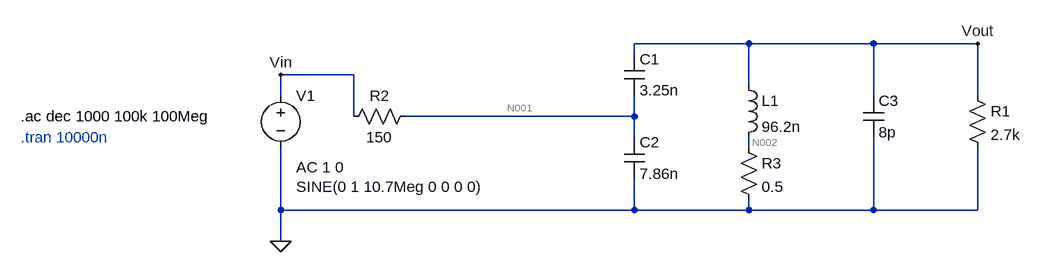
[diagram p0: schematic Draft7.asc]
Draft7.asc, the LTspice schematic file:
Version 4
SHEET 1 3220 680
WIRE 720 64 544 64
WIRE 912 64 720 64
WIRE 1072 64 912 64
WIRE 544 80 544 64
WIRE 112 112 0 112
WIRE 720 128 720 64
WIRE 0 144 0 112
WIRE 912 144 912 64
WIRE 1072 144 1072 64
WIRE 112 176 112 112
WIRE 544 176 544 144
WIRE 544 176 192 176
WIRE 544 208 544 176
WIRE 720 224 720 208
WIRE 0 320 0 224
WIRE 544 320 544 272
WIRE 544 320 0 320
WIRE 720 320 720 304
WIRE 720 320 544 320
WIRE 912 320 912 208
WIRE 912 320 720 320
WIRE 1072 320 1072 224
WIRE 1072 320 912 320
WIRE 0 368 0 320
FLAG 0 368 0
FLAG 0 112 Vin
FLAG 1072 64 Vout
SYMBOL voltage 0 128 R0
WINDOW 3 24 156 Left 2
WINDOW 123 24 126 Left 2
WINDOW 39 0 0 Left 0
SYMATTR Value SINE(0 1 10.7Meg 0 0 0 0)
SYMATTR Value2 AC 1 0
SYMATTR InstName V1
SYMBOL cap 528 80 R0
SYMATTR InstName C1
SYMATTR Value 3.25n
SYMBOL cap 528 208 R0
SYMATTR InstName C2
SYMATTR Value 7.86n
SYMBOL ind 704 112 R0
SYMATTR InstName L1
SYMATTR Value 96.2n
SYMBOL res 1056 128 R0
SYMATTR InstName R1
SYMATTR Value 2.7k
SYMBOL res 96 192 R270
WINDOW 0 32 56 VTop 2
WINDOW 3 0 56 VBottom 2
SYMATTR InstName R2
SYMATTR Value 150
SYMBOL cap 896 144 R0
SYMATTR InstName C3
SYMATTR Value 8p
SYMBOL res 704 208 R0
SYMATTR InstName R3
SYMATTR Value 0.5
TEXT -400 176 Left 2 !.ac dec 1000 100k 100Meg
TEXT -400 208 Left 2 ;.tran 10000n

The netlist it stands for:
* Draft7.asc
V1 Vin 0 SINE(0 1 10.7Meg 0 0 0 0) AC 1 0
C1 Vout N001 3.25n
C2 N001 0 7.86n
L1 Vout N002 96.2n
R1 Vout 0 2.7k
R2 Vin N001 150
C3 Vout 0 8p
R3 N002 0 0.5
.ac dec 1000 100k 100Meg
* .tran 10000n
.backanno
.end

* Results of the author's LTspice run, read from the files saved beside the schematic
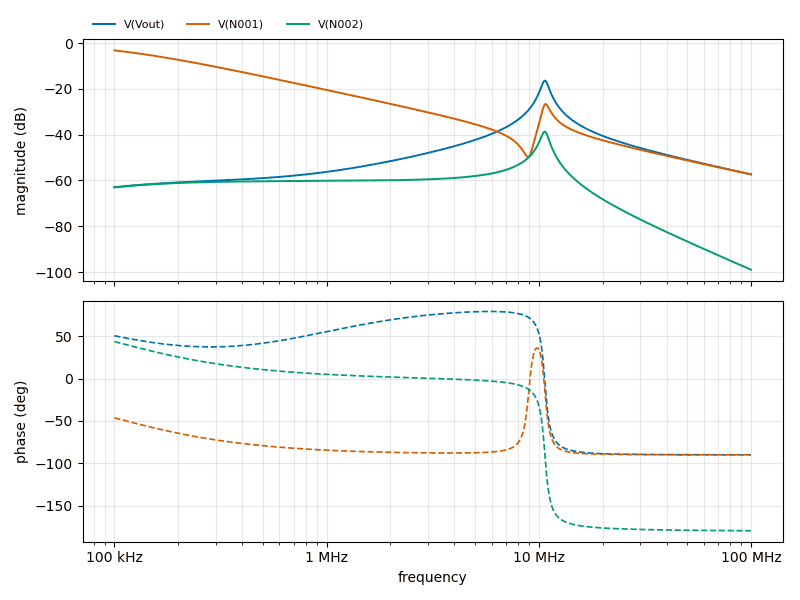
[diagram p1: AC Analysis of Draft7.asc, plotted from the saved traces]
* AC Analysis, 1 run:
*   V(Vout): -62.96 dB at 100 kHz, -57.32 dB at 100 MHz, peak -16.42 dB at 10.69 MHz, 3 dB below the peak at 10.25 MHz and 11.14 MHz
*   V(N001): -3.22 dB at 100 kHz, -57.37 dB at 100 MHz, peak -3.22 dB at 100 kHz, 3 dB below the peak at 170.6 kHz
*   V(N002): -63.04 dB at 100 kHz, -98.97 dB at 100 MHz, peak -38.66 dB at 10.67 MHz, 3 dB below the peak at 10.21 MHz and 11.1 MHz